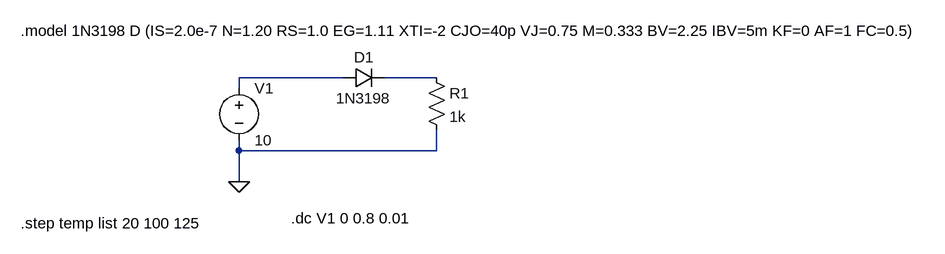
[diagram p0: schematic TP2 PUNTO 2.asc]
TP2 PUNTO 2.asc, the LTspice schematic file:
Version 4
SHEET 1 1264 680
WIRE 208 96 48 96
WIRE 352 96 272 96
WIRE 48 112 48 96
WIRE 48 208 48 192
WIRE 352 208 352 176
WIRE 352 208 48 208
WIRE 48 256 48 208
FLAG 48 256 0
SYMBOL res 336 80 R0
SYMATTR InstName R1
SYMATTR Value 1k
SYMBOL voltage 48 96 R0
WINDOW 123 0 0 Left 0
WINDOW 39 0 0 Left 0
SYMATTR InstName V1
SYMATTR Value 10
SYMBOL diode 208 112 R270
WINDOW 0 32 32 VTop 2
WINDOW 3 0 32 VBottom 2
SYMATTR InstName D1
SYMATTR Value 1N3198
TEXT 128 312 Left 2 !.dc V1 0 0.8 0.01
TEXT -288 24 Left 2 !.model 1N3198 D (IS=2.0e-7 N=1.20 RS=1.0 EG=1.11 XTI=-2 CJO=40p VJ=0.75 M=0.333 BV=2.25 IBV=5m KF=0 AF=1 FC=0.5)
TEXT -288 320 Left 2 !.step temp list 20 100 125

The netlist it stands for:
* TP2 PUNTO 2.asc
R1 N002 0 1k
V1 N001 0 10
D1 N001 N002 1N3198
.model D D
.lib standard.dio
.dc V1 0 0.8 0.01
.model 1N3198 D (IS=2.0e-7 N=1.20 RS=1.0 EG=1.11 XTI=-2 CJO=40p VJ=0.75 M=0.333 BV=2.25 IBV=5m KF=0 AF=1 FC=0.5)
.step temp list 20 100 125
.backanno
.end